# EAGLE schematic I2Cbasic (EAGLE 6.1)
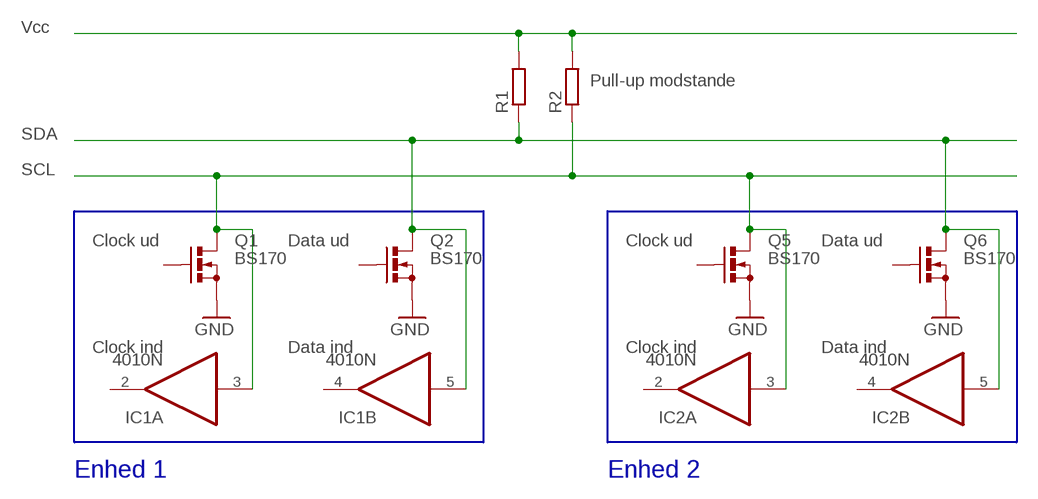
[diagram p0: schematic, sheet 1]

## Parts
IC1  4010N  [DIL16]
IC2  4010N  [DIL16]
Q1  BS170  [SOT54E]
Q2  BS170  [SOT54E]
Q5  BS170  [SOT54E]
Q6  BS170  [SOT54E]
R1  R-EU_0207/10  [0207/10]
R2  R-EU_0207/10  [0207/10]

## Nets
GND: Q1.S Q2.S Q5.S Q6.S
N$1: IC1.3(A:I) IC2.3(A:I) Q1.D Q5.D R2.1
N$2: IC1.5(B:I) IC2.5(B:I) Q2.D Q6.D R1.1
N$3: R1.2 R2.2
Unconnected: IC1.2(A:O) IC1.4(B:O) IC1.6(C:O) IC1.7(C:I) IC1.9(D:I) IC1.10(D:O) IC1.11(E:I) IC1.12(E:O) IC1.14(F:I) IC1.15(F:O) IC2.2(A:O) IC2.4(B:O) IC2.6(C:O) IC2.7(C:I) IC2.9(D:I) IC2.10(D:O) IC2.11(E:I) IC2.12(E:O) IC2.14(F:I) IC2.15(F:O) Q1.G Q2.G Q5.G Q6.G

## Notes on the sheet
- Vcc
- Pull-up modstande
- SDA
- SCL
- Clock ud | Data ud | Clock ud | Data ud
- Clock ind | Data ind | Clock ind | Data ind
- Enhed 1 | Enhed 2

## Power pins joined to a net without a drawn wire
VCC: IC1.1(P:VCC) IC2.1(P:VCC)
VDD: IC1.16(P:VDD) IC2.16(P:VDD)
VSS: IC1.8(P:VSS) IC2.8(P:VSS)

## Library data of the parts
IC1 IC2 = 40xx:4010: Hex BUFFER, non-inverting Source: www.fairchildsemi.com CD4010.pdf © 2000 Fairchild Semiconductor Corporation DS005945
Q1 Q2 Q5 Q6 = transistor-small-signal:BS170: N-CHANNEL MOS FET
R1 R2 = rcl:R-EU_: RESISTOR, European symbol